# EAGLE schematic attiny_x5 (EAGLE 9.1.3)
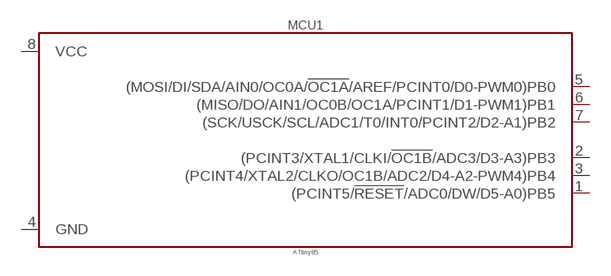
[diagram p0: schematic, sheet 1]

## Parts
MCU1  ATtiny85  ATTINY-X5_DIP-8_ATTINY-85  [DIP787W45P254L958H533Q8B_DIP-8_ATTINY-X5]
Unconnected: MCU1.1((PCINT5/!RESET!/ADC0/DW/D5-A0)PB5) MCU1.2((PCINT3/XTAL1/CLKI/!OC1B!/ADC3/D3-A3)PB3) MCU1.3((PCINT4/XTAL2/CLKO/OC1B/ADC2/D4-A2-PWM4)PB4) MCU1.4(GND) MCU1.5((MOSI/DI/SDA/AIN0/OC0A/!OC1A!/AREF/PCINT0/D0-PWM0)PB0) MCU1.6((MISO/DO/AIN1/OC0B/OC1A/PCINT1/D1-PWM1)PB1) MCU1.7((SCK/USCK/SCL/ADC1/T0/INT0/PCINT2/D2-A1)PB2) MCU1.8(VCC)

## Library data of the parts
MCU1 = PiB_ic_microcontrollers:ATTINY-X5; DATASHEET: http://www.microchip.com/mymicrochip/filehandler.aspx?ddocname=en589893; DIST: Digikey; DISTLINK: https://www.digikey.com/products/en?keywords=ATTINY85-20PU-ND; DISTPN: ATTINY85-20PU-ND; MFR: Microchip Technology; MPN: ATTINY85-20PU; SPICEPREFIX: X